# EAGLE design pic12f509-rgb-pwm (EAGLE 6.1)
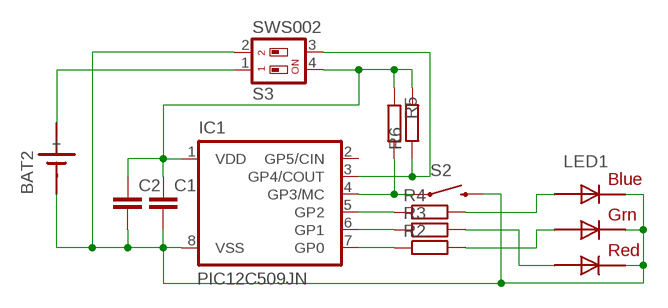
[diagram p0: schematic, sheet 1]

## Parts
BAT2  SN2032  [SN2032]
C1  C-EUC0805K  [C0805K]
C2  C-EUC0805K  [C0805K]
IC1  PIC12C509JN  [DIL8]
LED1  RGBLED5050  [RGBLED5050]
R2  R-EU_M0805  [M0805]
R3  R-EU_M0805  [M0805]
R4  R-EU_M0805  [M0805]
R5  R-EU_M0805  [M0805]
R6  R-EU_M0805  [M0805]
S2  SWITCH-MOMENTARY-2-SMD-1101NE  [TACTILE-SWITCH-1101NE]
S3  SWS002  [SMS-002]

## Nets
GND: BAT2.- C1.2 C2.2 IC1.8(VSS) LED1.4(BLUE_C) LED1.5(RED_C) LED1.6(GREEN_C) S2.2 S3.2
N$1: C1.1 C2.1 IC1.1(VDD) R5.1 R6.2 S3.4
N$2: LED1.1(GREEN_A) R2.2
N$3: BAT2.+ S3.1
N$4: IC1.4(GP3/MC) R5.2 S2.1
N$5: LED1.2(RED_A) R3.2
N$6: IC1.7(GP0) R2.1
N$7: IC1.6(GP1) R3.1
N$8: IC1.5(GP2) R4.1
N$9: LED1.3(BLUE_A) R4.2
N$12: IC1.3(GP4/COUT) R6.1 S3.3
Unconnected: IC1.2(GP5/CIN)

## Library data of the parts
BAT2 = sn2032:SN2032: LI BATTERY
C1 C2 = rcl:C-EU: CAPACITOR, European symbol
IC1 = microchip:PIC12C*?: MICROCONTROLLER; MF: MICROCHIP; MPN: PIC12C509A-04I/P; OC_FARNELL: 9758828; OC_NEWARK: 23C2958
LED1 = adafruit:RGBLED: For 5050 RGB LEDs, the order of the LEDs may vary from one manufacturer to another!
R2-R6 = rcl:R-EU_: RESISTOR, European symbol
S2 = SparkFun-Electromechanical:SWITCH-MOMENTARY-2: Various NO switches- pushbuttons, reed, etc
S3 = smd-special:SWS002: SMD Dip Switch 2 pol.

## Board
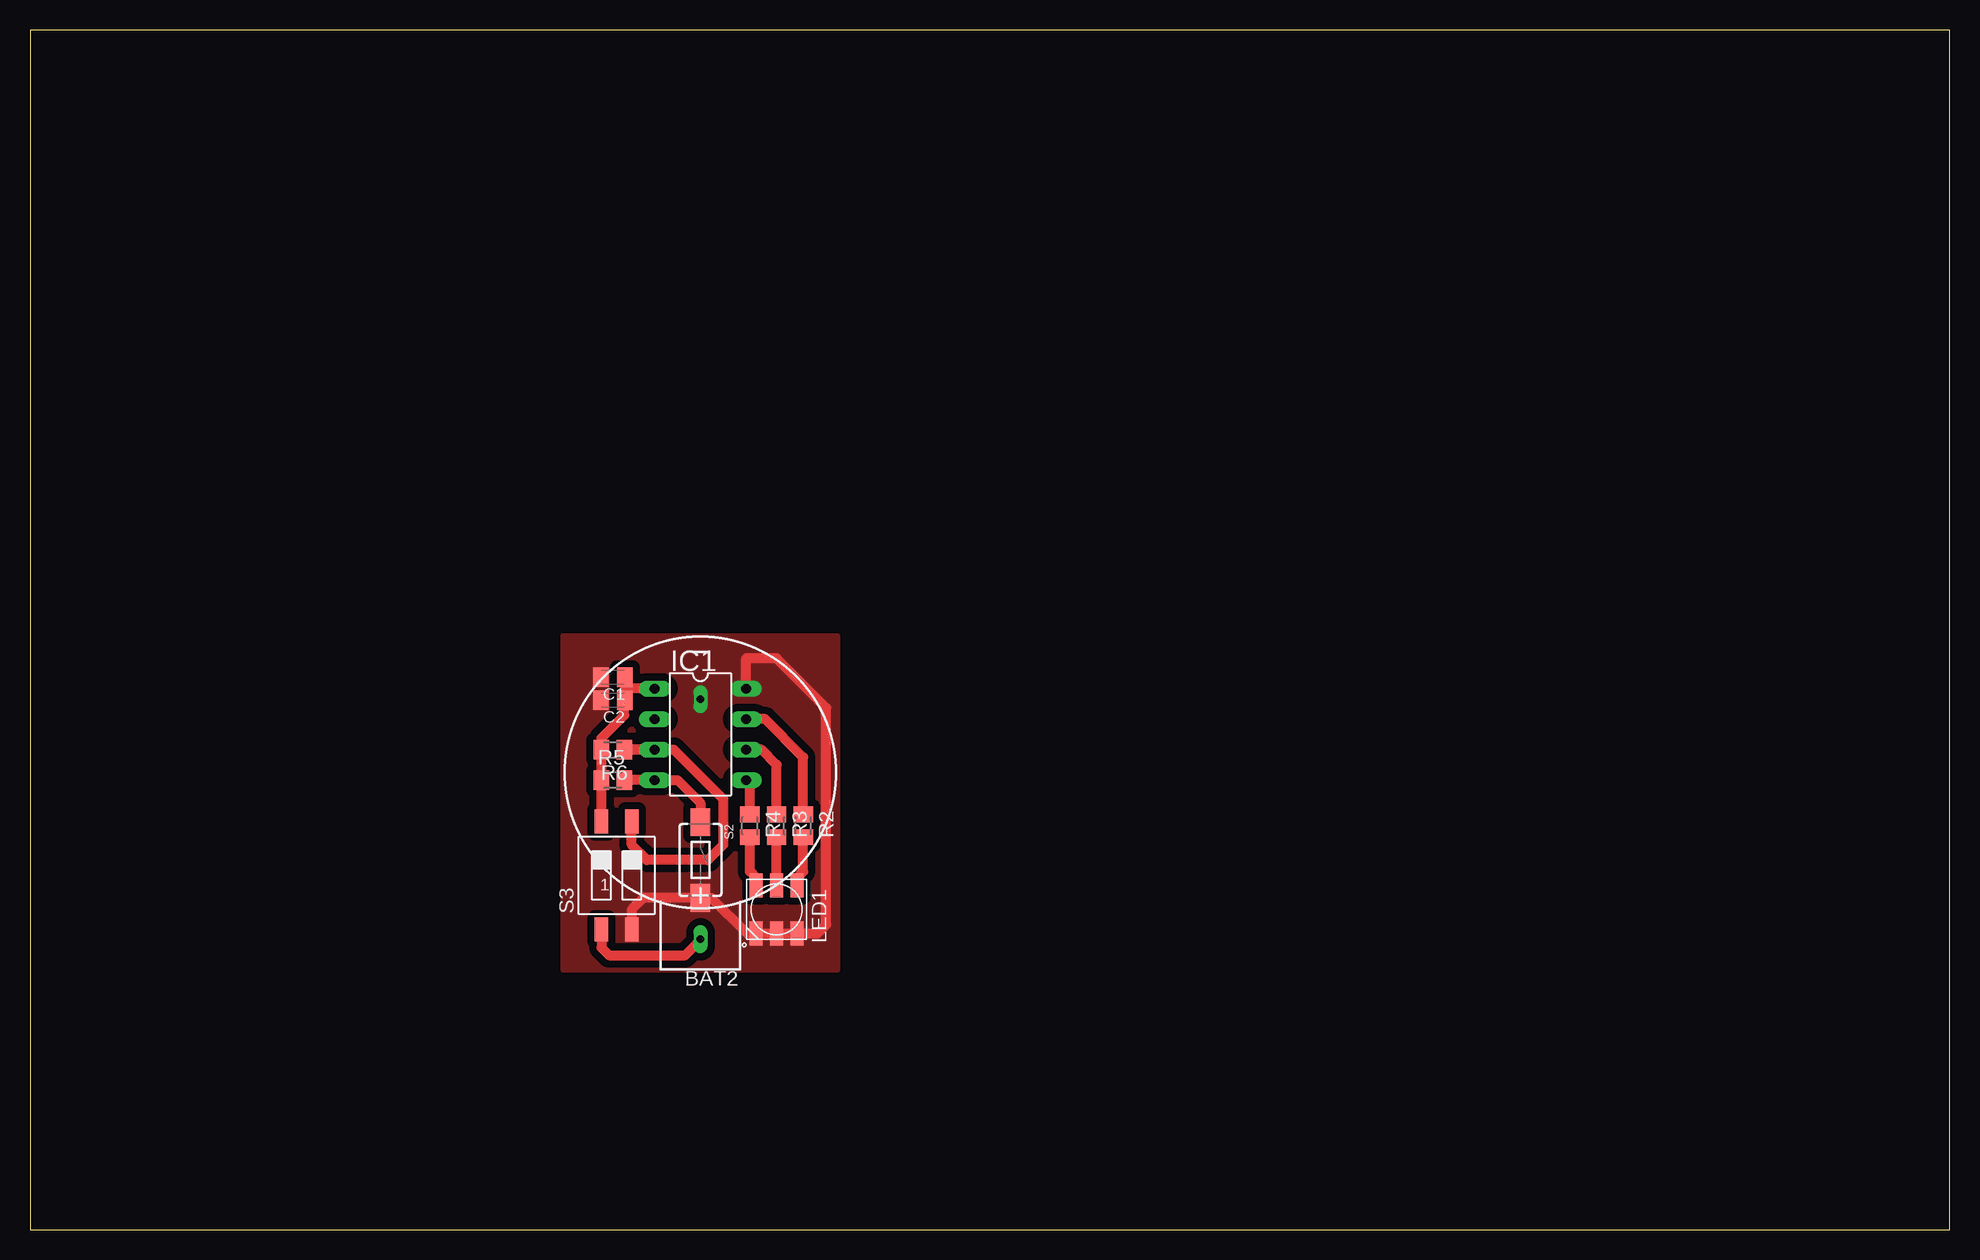
[diagram p1: board, top side]

Size 160 x 100 mm. Coordinates in mm from the lower left corner, seen from the top.
Outline: 0,0 160,0 160,100 0,100 0,0
Copper layers (1*16): Top 0.035mm / dielectric 1.5mm / Bottom 0.035mm
Design rules: minimum track width 10mil, minimum drill 24mil, track to track 12mil, track to pad 12mil, pad to pad 12mil, via to via 12mil, smd to smd 10mil, copper to edge 12mil, drill to drill 12mil, minimum pad ring 10mil, minimum via ring 10mil, stop-mask expansion 4mil, vias tented up to drill 0mil, thermal gap 12mil

### Footprints (pad centres in the part's own frame; a part is rotated, then mirrored left to right if it is on the bottom)
SN2032 = drill 0.65 long: + 0,13.9; - 0,-6.1
C0805K = smd 1.3 x 1.6: 1 -1,0; 2 1,0
DIL8 = drill 0.813 long: 1 -3.81,-3.81; 2 -1.27,-3.81; 3 1.27,-3.81; 4 3.81,-3.81; 5 3.81,3.81; 6 1.27,3.81; 7 -1.27,3.81; 8 -3.81,3.81
RGBLED5050 = smd 2 x 1.1: 1 -2,1.7; 2 -2,0; 3 -2,-1.7; 4 2,-1.7; 5 2,0; 6 2,1.7
M0805 = smd 1.3 x 1.6: 1 -0.95,0; 2 0.95,0
TACTILE-SWITCH-1101NE = smd 2.3 x 1.6: 1 -3.15,0; 2 3.15,0
SMS-002 = smd 1.092 x 2.007: 1 -1.27,-4.496; 2 1.27,-4.496; 3 1.27,4.496; 4 -1.27,4.496

### Placement (x,y rotation side)
BAT2  55.88,38.1 180 top
C1  48.58,46.04 180 top
C2  48.58,44.13 180 top
IC1  55.88,41.27 270 top
LED1  62.23,26.67 270 top
R2  64.45,33.66 270 top
R3  62.23,33.66 270 top
R4  60.01,33.66 270 top
R5  48.58,37.47 0 top
R6  48.58,40.01 180 top
S2  55.88,30.8 270 top
S3  48.9,29.53 0 top

### Tracks (layer width: path | path; a pad name or v marks a point on that pad's centre or on a via)
GND
  Top 0.813: S3.2 50.16,26.67 51.14,27.65 S2.2 55.91,27.62 56.83,27.62 59.78,24.67 LED1.4 63.82,24.67 63.82,24.77 | LED1.6 65.63,24.67 66.36,25.4 66.36,43.5 62.23,47.62 59.69,47.62 IC1.8
  pour Top (isolate 0.61, no thermals): 52.7,21.59 44.45,21.59 44.45,48.26 44.45,49.21 44.45,49.53 67.31,49.53 67.31,21.59
N$1  (2 unrouted)
  Top 0.813: R6.2 R5.1 S3.4 | R6.2 47.63,40.96 49.53,42.86 49.53,43.77 C2.1 | C1.1 49.58,45.09 | 49.58,45.09 49.58,43.86 49.53,43.81 | IC1.1 49.58,45.09
N$2
  Top 0.813: LED1.1 63.93,29.32 64.45,29.84 R2.2
N$3
  Top 0.813: S3.1 47.62,23.5 48.26,22.86 54.61,22.86 55.88,24.13 BAT2.+
N$4
  Top 0.813: S2.1 55.88,35.56 53.98,37.47 IC1.4 R5.2
N$5
  Top 0.813: LED1.2 R3.2
N$6
  Top 0.813: R2.1 64.45,39.37 61.28,42.55 IC1.7
N$7
  Top 0.813: R3.1 62.23,38.73 60.96,40.01 IC1.6
N$8
  Top 0.813: R4.1 60.01,37.15 IC1.5
N$9
  Top 0.813: LED1.3 60.53,29.32 60.01,29.84 R4.2
N$12  (1 unrouted)
  Top 0.813: IC1.3 R6.1 | R6.1 53.66,40.01 57.78,35.88 57.78,32.07 56.52,30.8 51.44,30.8 50.16,32.07 S3.3